# Altium schematic sheet carrier_board.SchDoc
size 594 x 420 mm
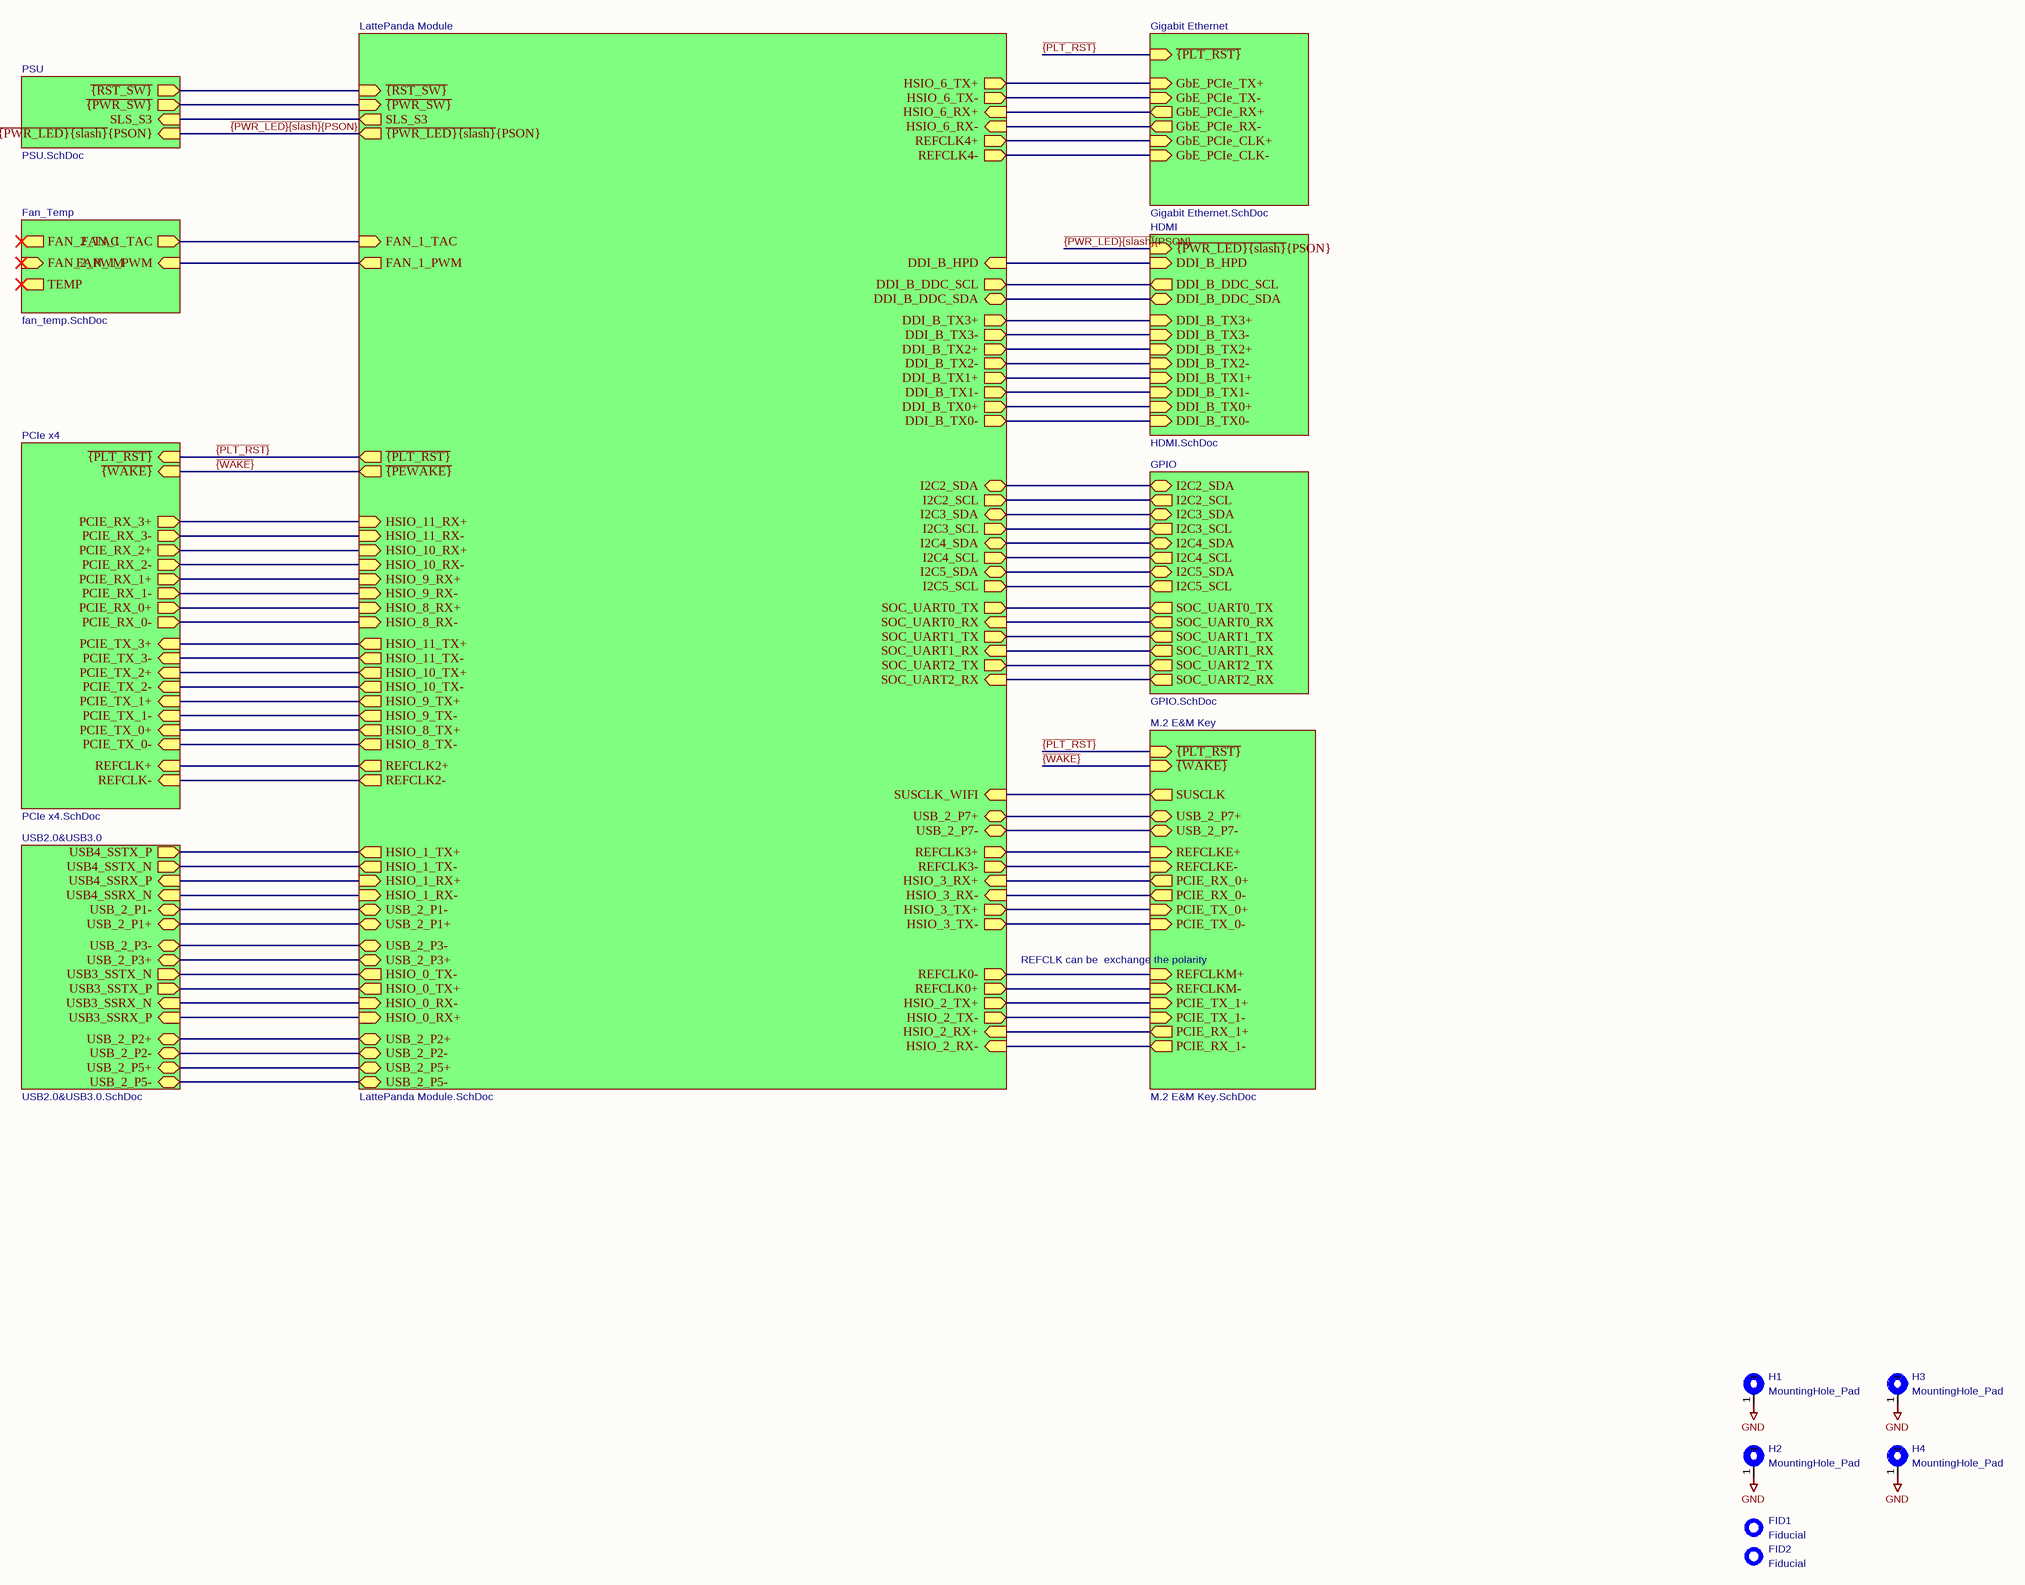
[diagram p0: carrier_board.SchDoc]

## Parts
FID1  Fiducial  [Fiducial_0.5mm_Mask1mm]
FID2  Fiducial  [Fiducial_0.5mm_Mask1mm]
H1  MountingHole_Pad  [MountingHole_3.2mm_M3_Pad_Via]
H2  MountingHole_Pad  [MountingHole_3.2mm_M3_Pad_Via]
H3  MountingHole_Pad  [MountingHole_3.2mm_M3_Pad_Via]
H4  MountingHole_Pad  [MountingHole_3.2mm_M3_Pad_Via]

## Sub-sheets
Fan_Temp = fan_temp.SchDoc: FAN_1_TAC (out), FAN_1_PWM (in), FAN_2_PWM (in), FAN_2_TAC (out), TEMP (out)
Gigabit Ethernet = Gigabit Ethernet.SchDoc: GbE_PCIe_CLK- (in), GbE_PCIe_RX+ (out), GbE_PCIe_RX- (out), GbE_PCIe_TX- (in), GbE_PCIe_TX+ (in), GbE_PCIe_CLK+ (in), ~{{PLT_RST}} (in)
GPIO = GPIO.SchDoc: I2C2_SCL (out), I2C4_SCL (out), I2C5_SCL (out), I2C3_SCL (out), SOC_UART0_TX (out), SOC_UART1_TX (out), SOC_UART2_TX (out), I2C3_SDA (bidir), I2C4_SDA (bidir), I2C5_SDA (bidir), I2C2_SDA (bidir), SOC_UART0_RX (out), SOC_UART2_RX (out), SOC_UART1_RX (out)
HDMI = HDMI.SchDoc: DDI_B_DDC_SCL (out), DDI_B_DDC_SDA (bidir), DDI_B_TX2+ (in), DDI_B_TX2- (in), DDI_B_TX1+ (in), DDI_B_TX1- (in), DDI_B_TX0- (in), DDI_B_TX3+ (in), DDI_B_TX3- (in), DDI_B_TX0+ (in), DDI_B_HPD (in), ~{{PWR_LED}{slash}}{PSON} (in)
LattePanda Module = LattePanda Module.SchDoc: HSIO_11_TX+ (out), HSIO_11_TX- (out), HSIO_11_RX+ (in), HSIO_11_RX- (in), HSIO_6_TX- (out), HSIO_6_RX+ (in), HSIO_6_RX- (in), HSIO_6_TX+ (out), USB_2_P1- (bidir), USB_2_P1+ (bidir), USB_2_P2+ (bidir), USB_2_P3+ (bidir), USB_2_P3- (bidir), USB_2_P2- (bidir), HSIO_8_TX+ (out), HSIO_8_TX- (out), HSIO_1_TX- (out), HSIO_1_RX+ (in), HSIO_1_RX- (in), HSIO_0_TX- (out), HSIO_0_TX+ (out), HSIO_9_TX- (out), HSIO_9_TX+ (out), HSIO_8_RX+ (in), HSIO_8_RX- (in), HSIO_9_RX+ (in), HSIO_10_RX- (in), HSIO_9_RX- (in), HSIO_10_RX+ (in), HSIO_10_TX+ (out), HSIO_10_TX- (out), HSIO_0_RX- (in), HSIO_1_TX+ (out), HSIO_0_RX+ (in), REFCLK2- (out), REFCLK2+ (out), REFCLK4- (out), REFCLK4+ (out), ~{{PLT_RST}} (out), ~{{PEWAKE}} (out), USB_2_P7+ (bidir), DDI_B_TX1+ (out), DDI_B_TX2+ (out), DDI_B_TX2- (out), DDI_B_TX0- (out), DDI_B_TX0+ (out), DDI_B_TX1- (out), DDI_B_TX3- (out), DDI_B_DDC_SDA (bidir), DDI_B_TX3+ (out), DDI_B_HPD (in), DDI_B_DDC_SCL (out), USB_2_P5- (bidir), USB_2_P5+ (bidir), ~{{PWR_LED}{slash}}{PSON} (out), ~{{PWR_SW}} (in), ~{{RST_SW}} (in), REFCLK0+ (out), REFCLK0- (out), SLS_S3 (out), HSIO_3_TX+ (out), HSIO_2_TX+ (out), HSIO_2_RX+ (in), HSIO_2_RX- (in), HSIO_2_TX- (out), HSIO_3_TX- (out), HSIO_3_RX+ (in), HSIO_3_RX- (in), SUSCLK_WIFI (in), SOC_UART0_RX (in), SOC_UART1_RX (in), SOC_UART1_TX (out), SOC_UART0_TX (out), SOC_UART2_RX (in), SOC_UART2_TX (out), I2C2_SCL (out), I2C3_SDA (bidir), I2C4_SCL (out), I2C2_SDA (bidir), I2C4_SDA (bidir), I2C3_SCL (out), I2C5_SDA (bidir), I2C5_SCL (out), REFCLK3+ (out), REFCLK3- (out), USB_2_P7- (bidir), FAN_1_PWM (out), FAN_1_TAC (in)
M.2 E&M Key = M.2 E&M Key.SchDoc: SUSCLK (out), REFCLKM+ (in), REFCLKM- (in), ~{{PLT_RST}} (in), ~{{WAKE}} (in), PCIE_TX_1+ (in), PCIE_RX_1+ (out), PCIE_RX_1- (out), PCIE_TX_1- (in), REFCLKE- (in), REFCLKE+ (in), USB_2_P7- (bidir), PCIE_TX_0- (in), USB_2_P7+ (bidir), PCIE_RX_0+ (out), PCIE_RX_0- (out), PCIE_TX_0+ (in)
PCIe x4 = PCIe x4.SchDoc: PCIE_RX_3- (out), PCIE_RX_2- (out), PCIE_RX_3+ (out), PCIE_RX_0- (out), PCIE_RX_1- (out), PCIE_RX_1+ (out), PCIE_RX_0+ (out), PCIE_RX_2+ (out), ~{{PLT_RST}} (in), REFCLK- (in), REFCLK+ (in), PCIE_TX_3- (in), PCIE_TX_3+ (in), PCIE_TX_2- (in), PCIE_TX_0+ (in), PCIE_TX_2+ (in), PCIE_TX_1- (in), PCIE_TX_0- (in), PCIE_TX_1+ (in), ~{{WAKE}} (in)
PSU = PSU.SchDoc: ~{{PWR_LED}{slash}}{PSON} (in), SLS_S3 (in), ~{{PWR_SW}} (out), ~{{RST_SW}} (out)
USB2.0&USB3.0 = USB2.0&USB3.0.SchDoc: USB3_SSRX_P (in), USB3_SSRX_N (in), USB3_SSTX_N (out), USB_2_P5+ (bidir), USB_2_P5- (bidir), USB3_SSTX_P (out), USB_2_P1+ (bidir), USB_2_P3- (bidir), USB_2_P3+ (bidir), USB_2_P1- (bidir), USB_2_P2+ (bidir), USB4_SSRX_N (in), USB4_SSRX_P (in), USB4_SSTX_N (out), USB4_SSTX_P (out), USB_2_P2- (bidir)

## Nets
GND: H1.1 H2.1 H3.1 H4.1
~{{PLT_RST}}: sheet PCIe x4/~{{PLT_RST}}, sheet LattePanda Module/~{{PLT_RST}}, sheet M.2 E&M Key/~{{PLT_RST}}, sheet Gigabit Ethernet/~{{PLT_RST}}
~{{PWR_LED}{slash}}{PSON}: sheet LattePanda Module/~{{PWR_LED}{slash}}{PSON}, sheet HDMI/~{{PWR_LED}{slash}}{PSON}, sheet PSU/~{{PWR_LED}{slash}}{PSON}
~{{WAKE}}: sheet PCIe x4/~{{WAKE}}, sheet LattePanda Module/~{{PEWAKE}}, sheet M.2 E&M Key/~{{WAKE}}
(unnamed): sheet PCIe x4/PCIE_RX_3-, sheet LattePanda Module/HSIO_11_RX-
(unnamed): sheet PCIe x4/PCIE_RX_2-, sheet LattePanda Module/HSIO_10_RX-
(unnamed): sheet PCIe x4/PCIE_RX_3+, sheet LattePanda Module/HSIO_11_RX+
(unnamed): sheet PCIe x4/PCIE_RX_0-, sheet LattePanda Module/HSIO_8_RX-
(unnamed): sheet PCIe x4/PCIE_RX_1-, sheet LattePanda Module/HSIO_9_RX-
(unnamed): sheet PCIe x4/PCIE_RX_1+, sheet LattePanda Module/HSIO_9_RX+
(unnamed): sheet PCIe x4/PCIE_RX_0+, sheet LattePanda Module/HSIO_8_RX+
(unnamed): sheet PCIe x4/PCIE_RX_2+, sheet LattePanda Module/HSIO_10_RX+
(unnamed): sheet PCIe x4/REFCLK-, sheet LattePanda Module/REFCLK2-
(unnamed): sheet PCIe x4/REFCLK+, sheet LattePanda Module/REFCLK2+
(unnamed): sheet PCIe x4/PCIE_TX_3-, sheet LattePanda Module/HSIO_11_TX-
(unnamed): sheet PCIe x4/PCIE_TX_3+, sheet LattePanda Module/HSIO_11_TX+
(unnamed): sheet PCIe x4/PCIE_TX_2-, sheet LattePanda Module/HSIO_10_TX-
(unnamed): sheet PCIe x4/PCIE_TX_0+, sheet LattePanda Module/HSIO_8_TX+
(unnamed): sheet PCIe x4/PCIE_TX_2+, sheet LattePanda Module/HSIO_10_TX+
(unnamed): sheet PCIe x4/PCIE_TX_1-, sheet LattePanda Module/HSIO_9_TX-
(unnamed): sheet PCIe x4/PCIE_TX_0-, sheet LattePanda Module/HSIO_8_TX-
(unnamed): sheet PCIe x4/PCIE_TX_1+, sheet LattePanda Module/HSIO_9_TX+
(unnamed): sheet Fan_Temp/FAN_1_TAC, sheet LattePanda Module/FAN_1_TAC
(unnamed): sheet Fan_Temp/FAN_1_PWM, sheet LattePanda Module/FAN_1_PWM
(unnamed): sheet LattePanda Module/HSIO_6_TX-, sheet Gigabit Ethernet/GbE_PCIe_TX-
(unnamed): sheet LattePanda Module/HSIO_6_RX+, sheet Gigabit Ethernet/GbE_PCIe_RX+
(unnamed): sheet LattePanda Module/HSIO_6_RX-, sheet Gigabit Ethernet/GbE_PCIe_RX-
(unnamed): sheet LattePanda Module/HSIO_6_TX+, sheet Gigabit Ethernet/GbE_PCIe_TX+
(unnamed): sheet LattePanda Module/USB_2_P1-, sheet USB2.0&USB3.0/USB_2_P1-
(unnamed): sheet LattePanda Module/USB_2_P1+, sheet USB2.0&USB3.0/USB_2_P1+
(unnamed): sheet LattePanda Module/USB_2_P2+, sheet USB2.0&USB3.0/USB_2_P2+
(unnamed): sheet LattePanda Module/USB_2_P3+, sheet USB2.0&USB3.0/USB_2_P3+
(unnamed): sheet LattePanda Module/USB_2_P3-, sheet USB2.0&USB3.0/USB_2_P3-
(unnamed): sheet LattePanda Module/USB_2_P2-, sheet USB2.0&USB3.0/USB_2_P2-
(unnamed): sheet LattePanda Module/HSIO_1_TX-, sheet USB2.0&USB3.0/USB4_SSTX_N
(unnamed): sheet LattePanda Module/HSIO_1_RX+, sheet USB2.0&USB3.0/USB4_SSRX_P
(unnamed): sheet LattePanda Module/HSIO_1_RX-, sheet USB2.0&USB3.0/USB4_SSRX_N
(unnamed): sheet LattePanda Module/HSIO_0_TX-, sheet USB2.0&USB3.0/USB3_SSTX_N
(unnamed): sheet LattePanda Module/HSIO_0_TX+, sheet USB2.0&USB3.0/USB3_SSTX_P
(unnamed): sheet LattePanda Module/HSIO_0_RX-, sheet USB2.0&USB3.0/USB3_SSRX_N
(unnamed): sheet LattePanda Module/HSIO_1_TX+, sheet USB2.0&USB3.0/USB4_SSTX_P
(unnamed): sheet LattePanda Module/HSIO_0_RX+, sheet USB2.0&USB3.0/USB3_SSRX_P
(unnamed): sheet LattePanda Module/REFCLK4-, sheet Gigabit Ethernet/GbE_PCIe_CLK-
(unnamed): sheet LattePanda Module/REFCLK4+, sheet Gigabit Ethernet/GbE_PCIe_CLK+
(unnamed): sheet LattePanda Module/USB_2_P7+, sheet M.2 E&M Key/USB_2_P7+
(unnamed): sheet LattePanda Module/DDI_B_TX1+, sheet HDMI/DDI_B_TX1+
(unnamed): sheet LattePanda Module/DDI_B_TX2+, sheet HDMI/DDI_B_TX2+
(unnamed): sheet LattePanda Module/DDI_B_TX2-, sheet HDMI/DDI_B_TX2-
(unnamed): sheet LattePanda Module/DDI_B_TX0-, sheet HDMI/DDI_B_TX0-
(unnamed): sheet LattePanda Module/DDI_B_TX0+, sheet HDMI/DDI_B_TX0+
(unnamed): sheet LattePanda Module/DDI_B_TX1-, sheet HDMI/DDI_B_TX1-
(unnamed): sheet LattePanda Module/DDI_B_TX3-, sheet HDMI/DDI_B_TX3-
(unnamed): sheet LattePanda Module/DDI_B_DDC_SDA, sheet HDMI/DDI_B_DDC_SDA
(unnamed): sheet LattePanda Module/DDI_B_TX3+, sheet HDMI/DDI_B_TX3+
(unnamed): sheet LattePanda Module/DDI_B_HPD, sheet HDMI/DDI_B_HPD
(unnamed): sheet LattePanda Module/DDI_B_DDC_SCL, sheet HDMI/DDI_B_DDC_SCL
(unnamed): sheet LattePanda Module/USB_2_P5-, sheet USB2.0&USB3.0/USB_2_P5-
(unnamed): sheet LattePanda Module/USB_2_P5+, sheet USB2.0&USB3.0/USB_2_P5+
(unnamed): sheet LattePanda Module/~{{PWR_SW}}, sheet PSU/~{{PWR_SW}}
(unnamed): sheet LattePanda Module/~{{RST_SW}}, sheet PSU/~{{RST_SW}}
(unnamed): sheet LattePanda Module/REFCLK0+, sheet M.2 E&M Key/REFCLKM-
(unnamed): sheet LattePanda Module/REFCLK0-, sheet M.2 E&M Key/REFCLKM+
(unnamed): sheet LattePanda Module/SLS_S3, sheet PSU/SLS_S3
(unnamed): sheet LattePanda Module/HSIO_3_TX+, sheet M.2 E&M Key/PCIE_TX_0+
(unnamed): sheet LattePanda Module/HSIO_2_TX+, sheet M.2 E&M Key/PCIE_TX_1+
(unnamed): sheet LattePanda Module/HSIO_2_RX+, sheet M.2 E&M Key/PCIE_RX_1+
(unnamed): sheet LattePanda Module/HSIO_2_RX-, sheet M.2 E&M Key/PCIE_RX_1-
(unnamed): sheet LattePanda Module/HSIO_2_TX-, sheet M.2 E&M Key/PCIE_TX_1-
(unnamed): sheet LattePanda Module/HSIO_3_TX-, sheet M.2 E&M Key/PCIE_TX_0-
(unnamed): sheet LattePanda Module/HSIO_3_RX+, sheet M.2 E&M Key/PCIE_RX_0+
(unnamed): sheet LattePanda Module/HSIO_3_RX-, sheet M.2 E&M Key/PCIE_RX_0-
(unnamed): sheet LattePanda Module/SUSCLK_WIFI, sheet M.2 E&M Key/SUSCLK
(unnamed): sheet LattePanda Module/SOC_UART0_RX, sheet GPIO/SOC_UART0_RX
(unnamed): sheet LattePanda Module/SOC_UART1_RX, sheet GPIO/SOC_UART1_RX
(unnamed): sheet LattePanda Module/SOC_UART1_TX, sheet GPIO/SOC_UART1_TX
(unnamed): sheet LattePanda Module/SOC_UART0_TX, sheet GPIO/SOC_UART0_TX
(unnamed): sheet LattePanda Module/SOC_UART2_RX, sheet GPIO/SOC_UART2_RX
(unnamed): sheet LattePanda Module/SOC_UART2_TX, sheet GPIO/SOC_UART2_TX
(unnamed): sheet LattePanda Module/I2C2_SCL, sheet GPIO/I2C2_SCL
(unnamed): sheet LattePanda Module/I2C3_SDA, sheet GPIO/I2C3_SDA
(unnamed): sheet LattePanda Module/I2C4_SCL, sheet GPIO/I2C4_SCL
(unnamed): sheet LattePanda Module/I2C2_SDA, sheet GPIO/I2C2_SDA
(unnamed): sheet LattePanda Module/I2C4_SDA, sheet GPIO/I2C4_SDA
(unnamed): sheet LattePanda Module/I2C3_SCL, sheet GPIO/I2C3_SCL
(unnamed): sheet LattePanda Module/I2C5_SDA, sheet GPIO/I2C5_SDA
(unnamed): sheet LattePanda Module/I2C5_SCL, sheet GPIO/I2C5_SCL
(unnamed): sheet LattePanda Module/REFCLK3+, sheet M.2 E&M Key/REFCLKE+
(unnamed): sheet LattePanda Module/REFCLK3-, sheet M.2 E&M Key/REFCLKE-
(unnamed): sheet LattePanda Module/USB_2_P7-, sheet M.2 E&M Key/USB_2_P7-

## Notes on the sheet
- REFCLK can be
  exchange the polarity
- 1
- 2
- 3
- 4
- 5
- 6
- 7
- 8
- 9
- 10
- 11
- A
- B
- C
- D
- E
- F
- G
- H
- 20240406
- Title: Primer Carrier for LattePanda Mu
- File: [DFR1142]Lite Carrier for LattePanda Mu.kicad_sch
- Sheet: /
- DFRobot
- KiCad E.D.A.  kicad (5.1.4)-1
- Size: A2
- Date: 2024-04-06
- Rev: V1.0.0
- Id: 1/1

## Library data of the parts
FID1 FID2 = Fiducial: Value: Fiducial; Footprint: A_HDJ_Library:Fiducial_0.5mm_Mask1mm
H1-H4 = MountingHole_Pad: Value: MountingHole_Pad; Footprint: A_HDJ_Library:MountingHole_3.2mm_M3_Pad_Via